# Altium project project.PrjPcb
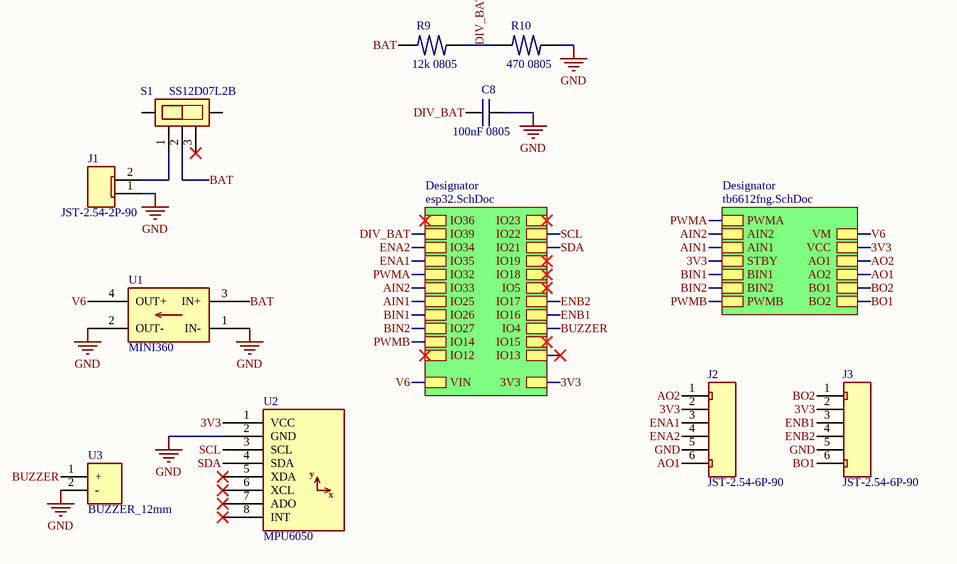
[diagram p0: schematic.SchDoc]
3 sheets, 33 parts. Net scope: hierarchical (ports join the sheet entries above them; power ports are global).
Board file: pcb.PcbDoc
Sheets:
  schematic.SchDoc
    Designator = esp32.SchDoc
    Designator = tb6612fng.SchDoc

## Sheet schematic.SchDoc
size A4; SheetNumber: 1; SheetTotal: 3

### Parts
C8  100nF 0805  [CAPACITOR 0805]
J1  JST-2.54-2P-90  [JST-2.54-2P-90]
J2  JST-2.54-6P-90  [JST-2.54-6P-90]
J3  JST-2.54-6P-90  [JST-2.54-6P-90]
R9  12k 0805  [RESISTOR_0805]
R10  470 0805  [RESISTOR_0805]
S1  SS12D07L2B  [SS12D07L2B]
U1  MINI360  [MINI360]
U2  MPU6050  [MPU6050]
U3  BUZZER_12mm  [BUZZER_12mm]

### Sub-sheets
Designator = esp32.SchDoc: IO23, IO22, IO21, IO19, IO18, IO5, IO17, IO16, IO4, IO15, IO13, IO12, IO14, IO27, IO26, IO25, IO33, IO32, IO35, IO34, IO39, IO36, 3V3, VIN
Designator = tb6612fng.SchDoc: AIN1, BIN1, BIN2, AIN2, STBY, PWMA, PWMB, AO1, AO2, BO1, VM, VCC, BO2

### Nets
GND: C8.2 J1.1 J2.5 J3.5 R10.1 U1.1(IN-) U1.2(OUT-) U2.2(GND) U3.2(-)
3V3: J2.2 J3.2 U2.1(VCC) ; sheet Designator/3V3, sheet Designator/STBY, sheet Designator/VCC
AIN1: sheet Designator/IO25, sheet Designator/AIN1
AIN2: sheet Designator/IO33, sheet Designator/AIN2
AO1: J2.6 ; sheet Designator/AO2
AO2: J2.1 ; sheet Designator/AO1
BAT: R9.2 S1.2 U1.3(IN+)
BIN1: sheet Designator/IO26, sheet Designator/BIN1
BIN2: sheet Designator/IO27, sheet Designator/BIN2
BO1: J3.6 ; sheet Designator/BO2
BO2: J3.1 ; sheet Designator/BO1
BUZZER: U3.1(+) ; sheet Designator/IO4
DIV_BAT: C8.1 R9.1 R10.2 ; sheet Designator/IO39
ENA1: J2.3 ; sheet Designator/IO35
ENA2: J2.4 ; sheet Designator/IO34
ENB1: J3.3 ; sheet Designator/IO16
ENB2: J3.4 ; sheet Designator/IO17
PWMA: sheet Designator/IO32, sheet Designator/PWMA
PWMB: sheet Designator/IO14, sheet Designator/PWMB
SCL: U2.3(SCL) ; sheet Designator/IO22
SDA: U2.4(SDA) ; sheet Designator/IO21
V6: U1.4(OUT+) ; sheet Designator/VIN, sheet Designator/VM  [project net 5V]
NetJ1_2: J1.2 S1.1

Not connected (* = marked no-connect by the designer): S1 3*; U2 5(XDA)* 6(XCL)* 7(ADO)* 8(INT)*

### Notes on the sheet
- (in symbol MPU6050) y; x

### Library data of the parts
C8 = CAPACITOR 0805: Generic Capacitor 0805, 2x1.25x1.4mm.
J1 = JST-2.54-2P-90: Female Connector JST 2 Vias, 2.54mm 90º.
J2 J3 = JST-2.54-6P-90: Female Connector JST 6 Vias, 2.54mm 90º.
R9 R10 = RESISTOR_0805
S1 = SS12D07L2B: Vertical Slide Switch 5 Pins 8.7x4.5x4.7mm.; JLCPCB PN: C480342
U1 = MINI360: MODULE BUCK STEP DOWN 3A 18x12mm; ComponentLink1Description: Datasheet; ComponentLink1URL: https://cdn-shop.adafruit.com/datasheets/MP2307_r1.9.pdf
U2 = MPU6050: IMU ACCEL/GYRO 3-AXIS I2C; ComponentLink1Description: Datasheet; ComponentLink1URL: https://invensense.tdk.com/wp-content/uploads/2015/02/MPU-6000-Datasheet1.pdf
U3 = BUZZER_12mm: BUZZER MAGNETIC 12MM; Digikey PN: 433-WT-1209T-ND; Mouser PN: 433-WT-1209T-ND

## Sheet esp32.SchDoc
size A4; SheetNumber: 2; SheetTotal: 3
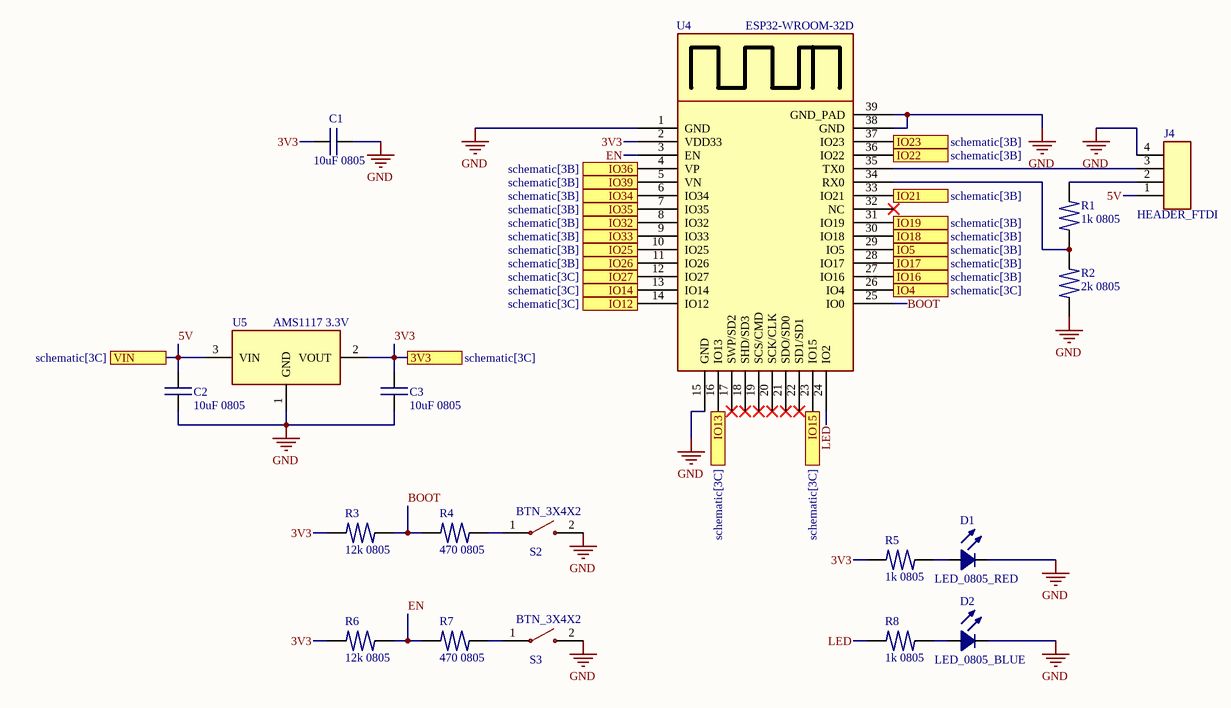
[diagram p1: esp32.SchDoc]

### Parts
C1  10uF 0805  [CAPACITOR 0805]
C2  10uF 0805  [CAPACITOR 0805]
C3  10uF 0805  [CAPACITOR 0805]
D1  LED_0805_RED  [LED_0805_RED]
D2  LED_0805_BLUE  [LED_0805_BLUE]
J4  HEADER_FTDI  [MALE-2.54-4P]
R1  1k 0805  [RESISTOR_0805]
R2  2k 0805  [RESISTOR_0805]
R3  12k 0805  [RESISTOR_0805]
R4  470 0805  [RESISTOR_0805]
R5  1k 0805  [RESISTOR_0805]
R6  12k 0805  [RESISTOR_0805]
R7  470 0805  [RESISTOR_0805]
R8  1k 0805  [RESISTOR_0805]
S2  BTN_3X4X2  [PUSH_BUTTON_SMD_3X4X2]
S3  BTN_3X4X2  [PUSH_BUTTON_SMD_3X4X2]
U4  ESP32-WROOM-32D  [ESP32-WROOM-32D]
U5  AMS1117 3.3V  [AMS1117]

### Ports
3V3 (see schematic[3C]), IO4 (see schematic[3C]), IO5 (see schematic[3B]), IO12 (see schematic[3C]), IO13 (see schematic[3C]), IO14 (see schematic[3C]), IO15 (see schematic[3C]), IO16 (see schematic[3B]), IO17 (see schematic[3B]), IO18 (see schematic[3B]), IO19 (see schematic[3B]), IO21 (see schematic[3B]), IO22 (see schematic[3B]), IO23 (see schematic[3B]), IO25 (see schematic[3B]), IO26 (see schematic[3B]), IO27 (see schematic[3C]), IO32 (see schematic[3B]), IO33 (see schematic[3B]), IO34 (see schematic[3B]), IO35 (see schematic[3B]), IO36 (see schematic[3B]), IO39 (see schematic[3B]), VIN (see schematic[3C])

### Nets
GND: C1.2 C2.1 C3.1 D1.2 D2.2 J4.4 R2.1 S2.2 S3.2 U4.1(GND) U4.15(GND) U4.38(GND) U4.39(GND_PAD) U5.1(GND)
3V3: C1.1 C3.2 R3.2 R5.2 R6.2 U4.2(VDD33) U5.2(VOUT) ; port 3V3
5V: C2.2 J4.1 U5.3(VIN) ; port VIN
AIN1: U4.10(IO25) ; port IO25
AIN2: U4.9(IO33) ; port IO33
BIN1: U4.11(IO26) ; port IO26
BIN2: U4.12(IO27) ; port IO27
BOOT: R3.1 R4.2 U4.25(IO0)
BUZZER: U4.26(IO4) ; port IO4
DIV_BAT: U4.5(VN) ; port IO39
EN: R6.1 R7.2 U4.3(EN)
ENA1: U4.7(IO35) ; port IO35
ENA2: U4.6(IO34) ; port IO34
ENB1: U4.27(IO16) ; port IO16
ENB2: U4.28(IO17) ; port IO17
LED: R8.1 U4.24(IO2)
PWMA: U4.8(IO32) ; port IO32
PWMB: U4.13(IO14) ; port IO14
SCL: U4.36(IO22) ; port IO22
SDA: U4.33(IO21) ; port IO21
NetD1_1: D1.1 R5.1
NetD2_1: D2.1 R8.2
NetJ4_2: J4.2 R1.2
NetJ4_3: J4.3 U4.35(TX0)
NetR1_1: R1.1 R2.2 U4.34(RX0)
NetR4_1: R4.1 S2.1
NetR7_1: R7.1 S3.1
NetU4_4: U4.4(VP) ; port IO36
NetU4_14: U4.14(IO12) ; port IO12
NetU4_16: U4.16(IO13) ; port IO13
NetU4_23: U4.23(IO15) ; port IO15
NetU4_29: U4.29(IO5) ; port IO5
NetU4_30: U4.30(IO18) ; port IO18
NetU4_31: U4.31(IO19) ; port IO19
NetU4_37: U4.37(IO23) ; port IO23

Not connected (* = marked no-connect by the designer): U4 17(SWP/SD2)* 18(SHD/SD3)* 19(SCS/CMD)* 20(SCK/CLK)* 21(SDO/SD0)* 22(SD1/SD1)* 32(NC)*

### Library data of the parts
C1-C3 = CAPACITOR 0805: Generic Capacitor 0805, 2x1.25x1.4mm.
J4 = MALE-2.54-4P: Male Header Connector 2.54mm 4 Pins.
R1 R2 R5 = RESISTOR_0805: Resistor SMD 0805 (1K); ComponentLink1Description: 10 PCS Resistor 1K; ComponentLink1URL: https://produto.mercadolivre.com.br/MLB-2624098004-1k-10-pecas-resistor-smd-0603-1k-ohms-1-16mmx08mm-_JM?matt_tool=63064967&matt_word=&matt_source=google&matt_campaign_id=14303413826&matt_ad_group_id=133431076203&matt_match_type=&matt_network=g&matt_device=c&matt_creative=584156655540&matt_keyword=&matt_ad_position=&matt_ad_type=pla&matt_merchant_id=215007955&matt_product_id=MLB2624098004&matt_product_partition_id=310365260760&matt_target_id=pla-310365260760&gclid=Cj0KCQiApKagBhC1ARIsAFc7Mc7UQciQkVF-VTYia6baZ8vnIuAOrlsCxaI4DIfsp2-v7xKfM_1xYSMaAsqLEALw_wcB
R3 R4 R6-R8 = RESISTOR_0805
S2 S3 = PUSH_BUTTON_SMD_3X4X2: Push Button Tactile Switch SMD 2 Pins 3x4x2mm.; JLCPCB PN: C231644
U4 = ESP32-WROOM-32D: Chip SMD 39 Pads Wifi 2.4GHz BLE 4.2 18x25.5mm w/ Antenna.; Mouser PN: ESP32-WROOM-32D-N4; Digikey PN: 1965-ESP32-WROOM-32D-N8CT-ND; ComponentLink1Description: Datasheet; ComponentLink1URL: https://www.mouser.com/datasheet/2/891/esp32_wroom_32d_esp32_wroom_32u_datasheet_en-1365844.pdf; JLCPCB PN: C82899
U5 = AMS1117: IC REG LINEAR 1A SOT-89-3L; ComponentLink1Description: Datasheet; ComponentLink1URL: http://www.advanced-monolithic.com/pdf/ds1117.pdf; Digikey PN: 4518-AMS1117-3.3CT-ND; JLCPCB PN: C963410

## Sheet tb6612fng.SchDoc
size A4; SheetNumber: 3; SheetTotal: 3
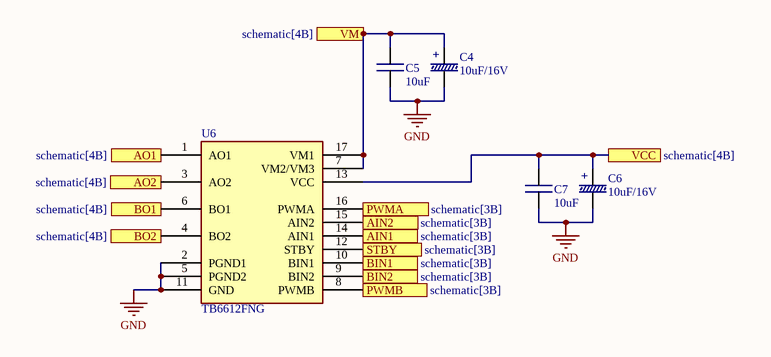
[diagram p2: tb6612fng.SchDoc]

### Parts
C4  10uF/16V  [ALUMINUM_4mm]
C5  10uF  [CAPACITOR 0805]
C6  10uF/16V  [ALUMINUM_4mm]
C7  10uF  [CAPACITOR 0805]
U6  TB6612FNG  [TB6612FNG]

### Ports
AIN1 (see schematic[3B]), AIN2 (see schematic[3B]), AO1 (see schematic[4B]), AO2 (see schematic[4B]), BIN1 (see schematic[3B]), BIN2 (see schematic[3B]), BO1 (see schematic[4B]), BO2 (see schematic[4B]), PWMA (see schematic[3B]), PWMB (see schematic[3B]), STBY (see schematic[3B]), VCC (see schematic[4B]), VM (see schematic[4B])

### Nets
GND: C4.2 C5.1 C6.2 C7.1 U6.2(PGND1) U6.5(PGND2) U6.11(GND)
3V3: C6.1 C7.2 U6.12(STBY) U6.13(VCC) ; port VCC, port STBY
5V: C4.1 C5.2 U6.7(VM2/VM3) U6.17(VM1) ; port VM
AIN1: U6.14(AIN1) ; port AIN1
AIN2: U6.15(AIN2) ; port AIN2
AO1: U6.3(AO2) ; port AO2
AO2: U6.1(AO1) ; port AO1
BIN1: U6.10(BIN1) ; port BIN1
BIN2: U6.9(BIN2) ; port BIN2
BO1: U6.4(BO2) ; port BO2
BO2: U6.6(BO1) ; port BO1
PWMA: U6.16(PWMA) ; port PWMA
PWMB: U6.8(PWMB) ; port PWMB

### Notes on the sheet
- (in symbol 10uF/16V) +

### Library data of the parts
C4 C6 = 10uF/16V: Aluminum Capacitor 10uF/16V 4mm
C5 C7 = CAPACITOR 0805: Generic Capacitor 0805, 2x1.25x1.4mm.
U6 = TB6612FNG: Dual Motor Driver 2.7-5.5V Logic 2.5-13.5V Motor 1A Continuos 3.2A Peak SSOP24; ComponentLink1Description: Datasheet; ComponentLink1URL: https://www.mouser.com/datasheet/2/408/TB6612FNG_datasheet_en_20141001-708260.pdf; Mouser PN: 757-TB6612FNGC8EL; Digikey PN: TB6612FNGC8ELCT-ND; JLCPCB PN: C141517

## Nets that join several sheets
GND: schematic (9 pins), esp32 (14 pins), tb6612fng (7 pins)
3V3: schematic (J2.2 J3.2 U2.1), esp32 (7 pins), tb6612fng (C6.1 C7.2 U6.12 U6.13)
5V: schematic (U1.4), esp32 (C2.2 J4.1 U5.3), tb6612fng (C4.1 C5.2 U6.7 U6.17)
AIN1: esp32 (U4.10), tb6612fng (U6.14)
AIN2: esp32 (U4.9), tb6612fng (U6.15)
AO1: schematic (J2.6), tb6612fng (U6.3)
AO2: schematic (J2.1), tb6612fng (U6.1)
BIN1: esp32 (U4.11), tb6612fng (U6.10)
BIN2: esp32 (U4.12), tb6612fng (U6.9)
BO1: schematic (J3.6), tb6612fng (U6.4)
BO2: schematic (J3.1), tb6612fng (U6.6)
BUZZER: schematic (U3.1), esp32 (U4.26)
DIV_BAT: schematic (C8.1 R9.1 R10.2), esp32 (U4.5)
ENA1: schematic (J2.3), esp32 (U4.7)
ENA2: schematic (J2.4), esp32 (U4.6)
ENB1: schematic (J3.3), esp32 (U4.27)
ENB2: schematic (J3.4), esp32 (U4.28)
PWMA: esp32 (U4.8), tb6612fng (U6.16)
PWMB: esp32 (U4.13), tb6612fng (U6.8)
SCL: schematic (U2.3), esp32 (U4.36)
SDA: schematic (U2.4), esp32 (U4.33)